# EAGLE design TFG (EAGLE 7.3.0)
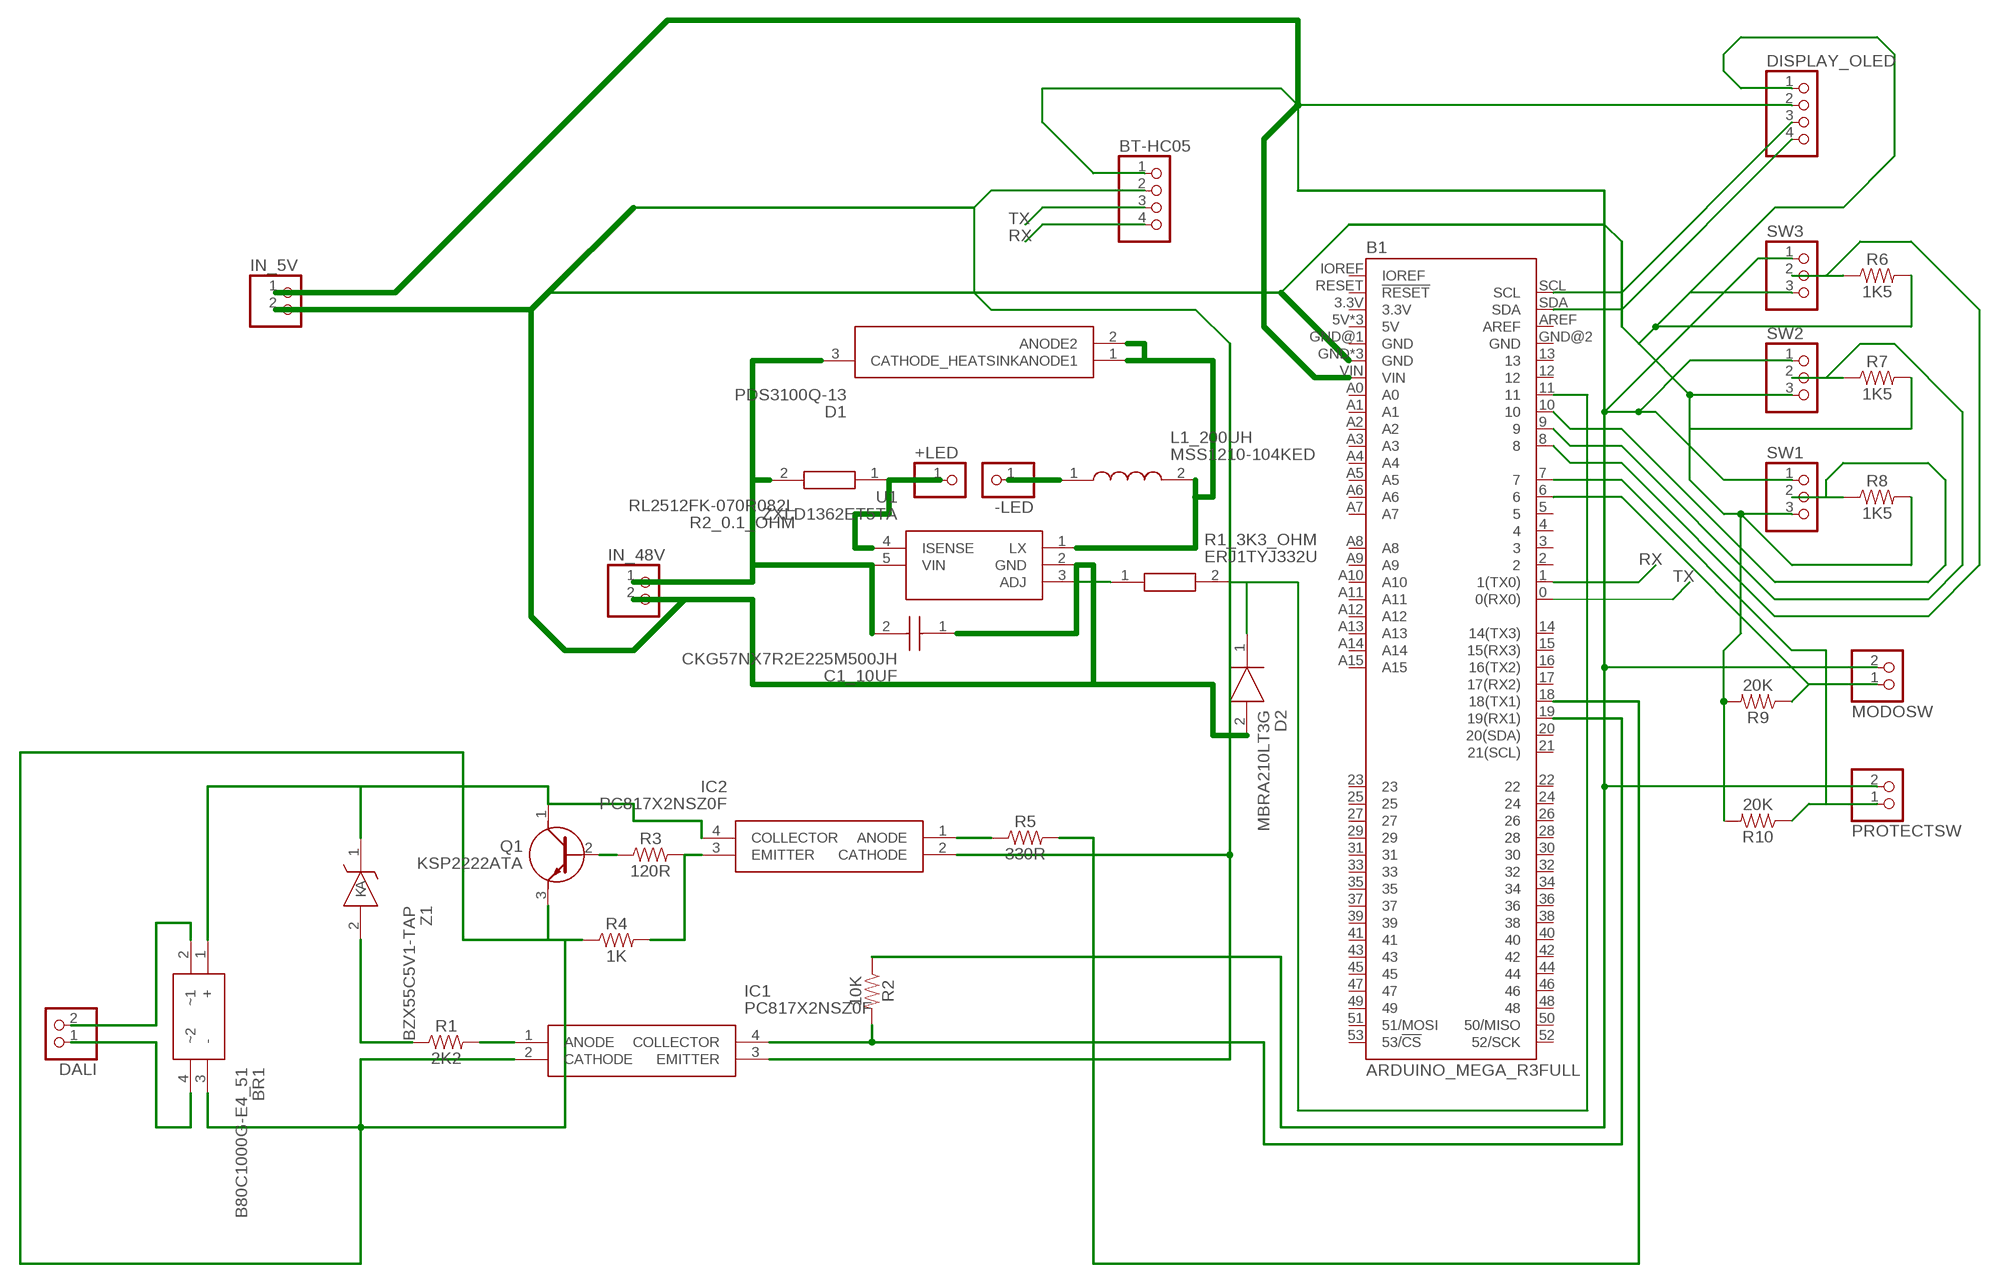
[diagram p0: schematic, sheet 1]

## Parts
+LED  PINHD-1X1  [1X01]
-LED  PINHD-1X1  [1X01]
B1  ARDUINO_MEGA_R3FULL  [ARDUINO_MEGA_NO_SILK]
BR1  B80C1000G-E4_51  [WOG_1]
BT-HC05  PINHD-1X4  [1X04]
C1_10UF  CKG57NX7R2E225M500JH  [CAPC6050X550N]
D1  PDS3100Q-13  [POWERDI5]
D2  MBRA210LT3G  [DIOM5226X220N]
DALI  PINHD-1X2  [1X02]
DISPLAY_OLED  PINHD-1X4  [1X04]
IC1  PC817X2NSZ0F  [DIP762W60P254L458H400Q4N]
IC2  PC817X2NSZ0F  [DIP762W60P254L458H400Q4N]
IN_5V  PINHD-1X2  [1X02]
IN_48V  PINHD-1X2  [1X02]
L1_200UH  MSS1210-104KED  [INDPM120120X1020N]
MODOSW  PINHD-1X2  [1X02]
PROTECTSW  PINHD-1X2  [1X02]
Q1  KSP2222ATA  [TO-92_FAIRCHILD]
R1  2K2  10MOHM-HORIZ-1/4W-5%  [AXIAL-0.3]
R1_3K3_OHM  ERJ1TYJ332U  [RESC6432X70N]
R2  10K  10MOHM-HORIZ-1/4W-5%  [AXIAL-0.3]
R2_0.1_OHM  RL2512FK-070R082L  [RESC6432X65N]
R3  120R  10MOHM-HORIZ-1/4W-5%  [AXIAL-0.3]
R4  1K  10MOHM-HORIZ-1/4W-5%  [AXIAL-0.3]
R5  330R  10MOHM-HORIZ-1/4W-5%  [AXIAL-0.3]
R6  1K5  10MOHM-HORIZ-1/4W-5%  [AXIAL-0.3]
R7  1K5  10MOHM-HORIZ-1/4W-5%  [AXIAL-0.3]
R8  1K5  10MOHM-HORIZ-1/4W-5%  [AXIAL-0.3]
R9  20K  10MOHM-HORIZ-1/4W-5%  [AXIAL-0.3]
R10  20K  10MOHM-HORIZ-1/4W-5%  [AXIAL-0.3]
SW1  PINHD-1X3  [1X03]
SW2  PINHD-1X3  [1X03]
SW3  PINHD-1X3  [1X03]
U1  ZXLD1362ET5TA  [SOT95P270X145-5N]
Z1  BZX55C5V1-TAP  [DIOAD950W60L350D150]

## Nets
2: C1_10UF.2 D1.3(CATHODE_HEATSINK) IN_48V.1 R2_0.1_OHM.2 U1.5(VIN)
N$2: D1.1(ANODE1) D1.2(ANODE2) L1_200UH.2 U1.1(LX)
N$3: B1.GND B1.GND@3(GND) B1.GND@4(GND) BT-HC05.2 C1_10UF.1 D2.2(A) DISPLAY_OLED.1 IC1.3(EMITTER) IC2.2(CATHODE) IN_5V.2 IN_48V.2 R6.P$2 R7.P$2 R8.P$2 R9.P$2 R10.P$2 SW1.3 SW2.3 SW3.3 U1.2(GND)
N$5: -LED.1 L1_200UH.1
N$6: +LED.1 R2_0.1_OHM.1 U1.4(ISENSE)
N$7: B1.9 R7.P$1 SW2.2
N$8: B1.10 R8.P$1 SW1.2
N$9: B1.8 R6.P$1 SW3.2
N$10: R1_3K3_OHM.1 U1.3(ADJ)
N$11: B1.11 D2.1(K) R1_3K3_OHM.2
N$12: BR1.2(~1) DALI.2
N$13: BR1.4(~2) DALI.1
N$14: B1.6 MODOSW.1 R9.P$1
N$15: BR1.1(+) IC2.4(COLLECTOR) Q1.1(C) Z1.1(K)
N$16: R1.P$1 Z1.2(A)
N$17: IC1.1(ANODE) R1.P$2
N$18: B1.19(19(RX1)) IC1.4(COLLECTOR) R2.P$2
N$19: B1.VIN BT-HC05.1 DISPLAY_OLED.2 IN_5V.1 MODOSW.2 PROTECTSW.2 R2.P$1 SW1.1 SW2.1 SW3.1
N$21: IC2.3(EMITTER) R3.P$2 R4.P$2
N$22: Q1.2(B) R3.P$1
N$23: BR1.3(-) IC1.2(CATHODE) Q1.3(E) R4.P$1
N$24: B1.18(18(TX1)) R5.P$2
N$25: IC2.1(ANODE) R5.P$1
N$27: B1.7 PROTECTSW.1 R10.P$1
N$29: B1.SCL DISPLAY_OLED.3
N$30: B1.SDA DISPLAY_OLED.4
RX: B1.1(1(TX0)) BT-HC05.4
TX: B1.0(0(RX0)) BT-HC05.3
Unconnected: B1.2 B1.3 B1.3.3V B1.4 B1.5 B1.5V B1.5V@1(5V) B1.5V@2(5V) B1.12 B1.13 B1.14(14(TX3)) B1.15(15(RX3)) B1.16(16(TX2)) B1.17(17(RX2)) B1.20(20(SDA)) B1.21(21(SCL)) B1.22 B1.23 B1.24 B1.25 B1.26 B1.27 B1.28 B1.29 B1.30 B1.31 B1.32 B1.33 B1.34 B1.35 B1.36 B1.37 B1.38 B1.39 B1.40 B1.41 B1.42 B1.43 B1.44 B1.45 B1.46 B1.47 B1.48 B1.49 B1.50(50/MISO) B1.51(51/MOSI) B1.52(52/SCK) B1.53(53/!CS) B1.A0 B1.A1 B1.A2 B1.A3 B1.A4 B1.A5 B1.A6 B1.A7 B1.A8 B1.A9 B1.A10 B1.A11 B1.A12 B1.A13 B1.A14 B1.A15 B1.AREF B1.GND@1(GND) B1.GND@2(GND) B1.IOREF B1.RESET(!RESET)

## Library data of the parts
+LED -LED = pinhead:PINHD-1X1: PIN HEADER
B1 = SparkFun-Boards:ARDUINO_MEGA_R3: Arduino Mega R3 ATmega2560 R3 compatible footprint. SparkFun Products: Arduino Mega 2560 R3 <https://www.sparkfun.com/products/11061>
BR1 = LibABL:B80C1000G-E4_51: Vishay B80C1000G-E4/51, Bridge Rectifier, 1.2A 125V, 4-Pin WOG Source: Datasheet <http://www.vishay.com/docs/88500/b40c1000g.pdf>; ARROW_PART_NUMBER: B80C1000G-E4/51; ARROW_PRICE/STOCK: http://uk.rs-online.com/web/p/products/1656361; DESCRIPTION: Vishay B80C1000G-E4/51, Bridge Rectifier, 1.2A 125V, 4-Pin WOG; HEIGHT: mm; MANUFACTURER_NAME: Vishay; MANUFACTURER_PART_NUMBER: B80C1000G-E4/51; RS_PART_NUMBER: 1656361; RS_PRICE/STOCK: http://uk.rs-online.com/web/p/products/1656361
BT-HC05 DISPLAY_OLED = pinhead:PINHD-1X4: PIN HEADER
C1_10UF = LibABL:CKG57NX7R2E225M500JH: 2220 X7R Ceramic Capacitor 250V 2.2uF TDK 2.2F Multilayer Ceramic Capacitor (MLCC) 250 V 20% X7R dielectric CKG Surface Mount max op. temp. +125C Source: Datasheet <https://product.tdk.com/info/en/catalog/datasheets/mlcc_commercial_megacap_en.pdf>; ARROW_PART_NUMBER: CKG57NX7R2E225M500JH; ARROW_PRICE/STOCK: https://www.arrow.com/en/products/ckg57nx7r2e225m500jh/tdk; DESCRIPTION: 2220 X7R Ceramic Capacitor 250V 2.2uF TDK 2.2F Multilayer Ceramic Capacitor (MLCC) 250 V 20% X7R dielectric CKG Surface Mount max op. temp. +125C; HEIGHT: 5.5mm; MANUFACTURER_NAME: TDK; MANUFACTURER_PART_NUMBER: CKG57NX7R2E225M500JH; RS_PART_NUMBER: 9214328; RS_PRICE/STOCK: http://uk.rs-online.com/web/p/products/9214328
D1 = LibABL:PDS3100Q-13: Schottky Diodes & Rectifiers Source: Datasheet <https://www.diodes.com/assets/Datasheets/PDS3100Q.pdf>; ARROW_PART_NUMBER: PDS3100Q-13; ARROW_PRICE/STOCK: https://www.arrow.com/en/products/pds3100q-13/diodes-incorporated; DESCRIPTION: Schottky Diodes & Rectifiers; HEIGHT: mm; MANUFACTURER_NAME: Diodes Inc.; MANUFACTURER_PART_NUMBER: PDS3100Q-13
D2 = LibABL:MBRA210LT3G: Source: Datasheet <http://www.onsemi.com/pub/Collateral/MBRA210LT3-D.PDF>; ALLIED_NUMBER: 70339903; ALLIED_PRICE/STOCK: http://www.alliedelec.com/on-semiconductor-mbra210lt3g/70339903/; ARROW_PART_NUMBER: MBRA210LT3G; ARROW_PRICE/STOCK: https://www.arrow.com/en/products/mbra210lt3g/on-semiconductor; HEIGHT: 2.2mm; MANUFACTURER_NAME: ON Semiconductor; MANUFACTURER_PART_NUMBER: MBRA210LT3G; RS_PART_NUMBER: 7925612P; RS_PRICE/STOCK: http://uk.rs-online.com/web/p/products/7925612P
DALI IN_5V IN_48V MODOSW PROTECTSW = pinhead:PINHD-1X2: PIN HEADER
IC1 IC2 = LibABL:PC817X2NSZ0F: Photocoupler 1-CH Transistor 4-Pin PDIP Sharp PC817X2NSZ0F DC Input Transistor Output Optocoupler, Through Hole, 4-Pin PDIP Source: Datasheet <http://www.sharp-world.com/products/device/lineup/data/pdf/datasheet/pc817xnnsz_e.pdf>; ARROW_PART_NUMBER: PC817X2NSZ0F; ARROW_PRICE/STOCK: http://uk.rs-online.com/web/p/products/8264687P; DESCRIPTION: Photocoupler 1-CH Transistor 4-Pin PDIP Sharp PC817X2NSZ0F DC Input Transistor Output Optocoupler, Through Hole, 4-Pin PDIP; HEIGHT: 4mm; MANUFACTURER_NAME: Sharp Microelectronics; MANUFACTURER_PART_NUMBER: PC817X2NSZ0F; RS_PART_NUMBER: 8264687P; RS_PRICE/STOCK: http://uk.rs-online.com/web/p/products/8264687P
L1_200UH = LibABL:MSS1210-104KED: COILCRAFT - MSS1210-104KED - INDUCTOR, PWR, 100UH,3.4A,10%,3.6MHZ Source: Datasheet <http://www.coilcraft.com/pdfs/MSS1210.pdf>; ARROW_PART_NUMBER: MSS1210-104KED; DESCRIPTION: COILCRAFT - MSS1210-104KED - INDUCTOR, PWR, 100UH,3.4A,10%,3.6MHZ; HEIGHT: 10.2mm; MANUFACTURER_NAME: COILCRAFT; MANUFACTURER_PART_NUMBER: MSS1210-104KED
Q1 = LibABL:KSP2222ATA: Transistor GP BJT NPN 40V 0.6A TO92-3 Source: Datasheet <http://docs-europe.electrocomponents.com/webdocs/0f9b/0900766b80f9b313.pdf>; ARROW_PART_NUMBER: KSP2222ATA; ARROW_PRICE/STOCK: http://uk.rs-online.com/web/p/bipolar-transistors/7390417/?source=DS; DESCRIPTION: Transistor GP BJT NPN 40V 0.6A TO92-3; HEIGHT: mm; MANUFACTURER_NAME: Fairchild Semiconductor; MANUFACTURER_PART_NUMBER: KSP2222ATA; RS_PART_NUMBER: 7390417; RS_PRICE/STOCK: http://uk.rs-online.com/web/p/bipolar-transistors/7390417/?source=DS
R1-R10 = SparkFun-Resistors:10MOHM: RES-09327; PROD_ID: RES-09327; VALUE: 10M
R1_3K3_OHM = LibABL:ERJ1TYJ332U: PANASONIC ELECTRONIC COMPONENTS - ERJ1TYJ332U - RES, THICK FILM, 3K3, 5%, 1W, 2512 Source: Datasheet <https://industrial.panasonic.com/cdbs/www-data/pdf/RDA0000/AOA0000C84.pdf>; ARROW_PART_NUMBER: ERJ1TYJ332U; DESCRIPTION: PANASONIC ELECTRONIC COMPONENTS - ERJ1TYJ332U - RES, THICK FILM, 3K3, 5%, 1W, 2512; HEIGHT: 0.7mm; MANUFACTURER_NAME: Panasonic; MANUFACTURER_PART_NUMBER: ERJ1TYJ332U
R2_0.1_OHM = LibABL:RL2512FK-070R082L: Current Sense Resistors - SMD 0.082 Ohm 1% 1W Source: Datasheet <https://www.mouser.com/ds/2/447/PYu-RL_521_RoHS_L_5-2927.pdf>; ARROW_PART_NUMBER: RL2512FK-070R082L; DESCRIPTION: Current Sense Resistors - SMD 0.082 Ohm 1% 1W; HEIGHT: 0.65mm; MANUFACTURER_NAME: YAGEO (PHYCOMP); MANUFACTURER_PART_NUMBER: RL2512FK-070R082L
SW1-SW3 = pinhead:PINHD-1X3: PIN HEADER
U1 = LibABL:ZXLD1362ET5TA: 60V 1A LED DRIVER WITH AEC-Q100 Source: Datasheet <http://componentsearchengine.com/Datasheets/1/ZXLD1362ET5TA.pdf>; ARROW_PART_NUMBER: ZXLD1362ET5TA; ARROW_PRICE/STOCK: https://www.arrow.com/en/products/zxld1362et5ta/diodes-incorporated; DESCRIPTION: 60V 1A LED DRIVER WITH AEC-Q100; HEIGHT: mm; MANUFACTURER_NAME: Diodes Inc.; MANUFACTURER_PART_NUMBER: ZXLD1362ET5TA; RS_PART_NUMBER: 1219947; RS_PRICE/STOCK: http://uk.rs-online.com/web/p/products/1219947
Z1 = LibABL:BZX55C5V1-TAP: Vishay Zener Diode, 5.1V 6% 500 mW Through Hole 2-Pin DO-35 Source: Datasheet <http://www.farnell.com/datasheets/2046255.pdf>; ARROW_PART_NUMBER: BZX55C5V1-TAP; ARROW_PRICE/STOCK: https://www.arrow.com/en/products/bzx55c5v1-tap/vishay; DESCRIPTION: Vishay Zener Diode, 5.1V 6% 500 mW Through Hole 2-Pin DO-35; HEIGHT: mm; MANUFACTURER_NAME: Vishay; MANUFACTURER_PART_NUMBER: BZX55C5V1-TAP; RS_PART_NUMBER: 6997809P; RS_PRICE/STOCK: http://uk.rs-online.com/web/p/products/6997809P

## Board
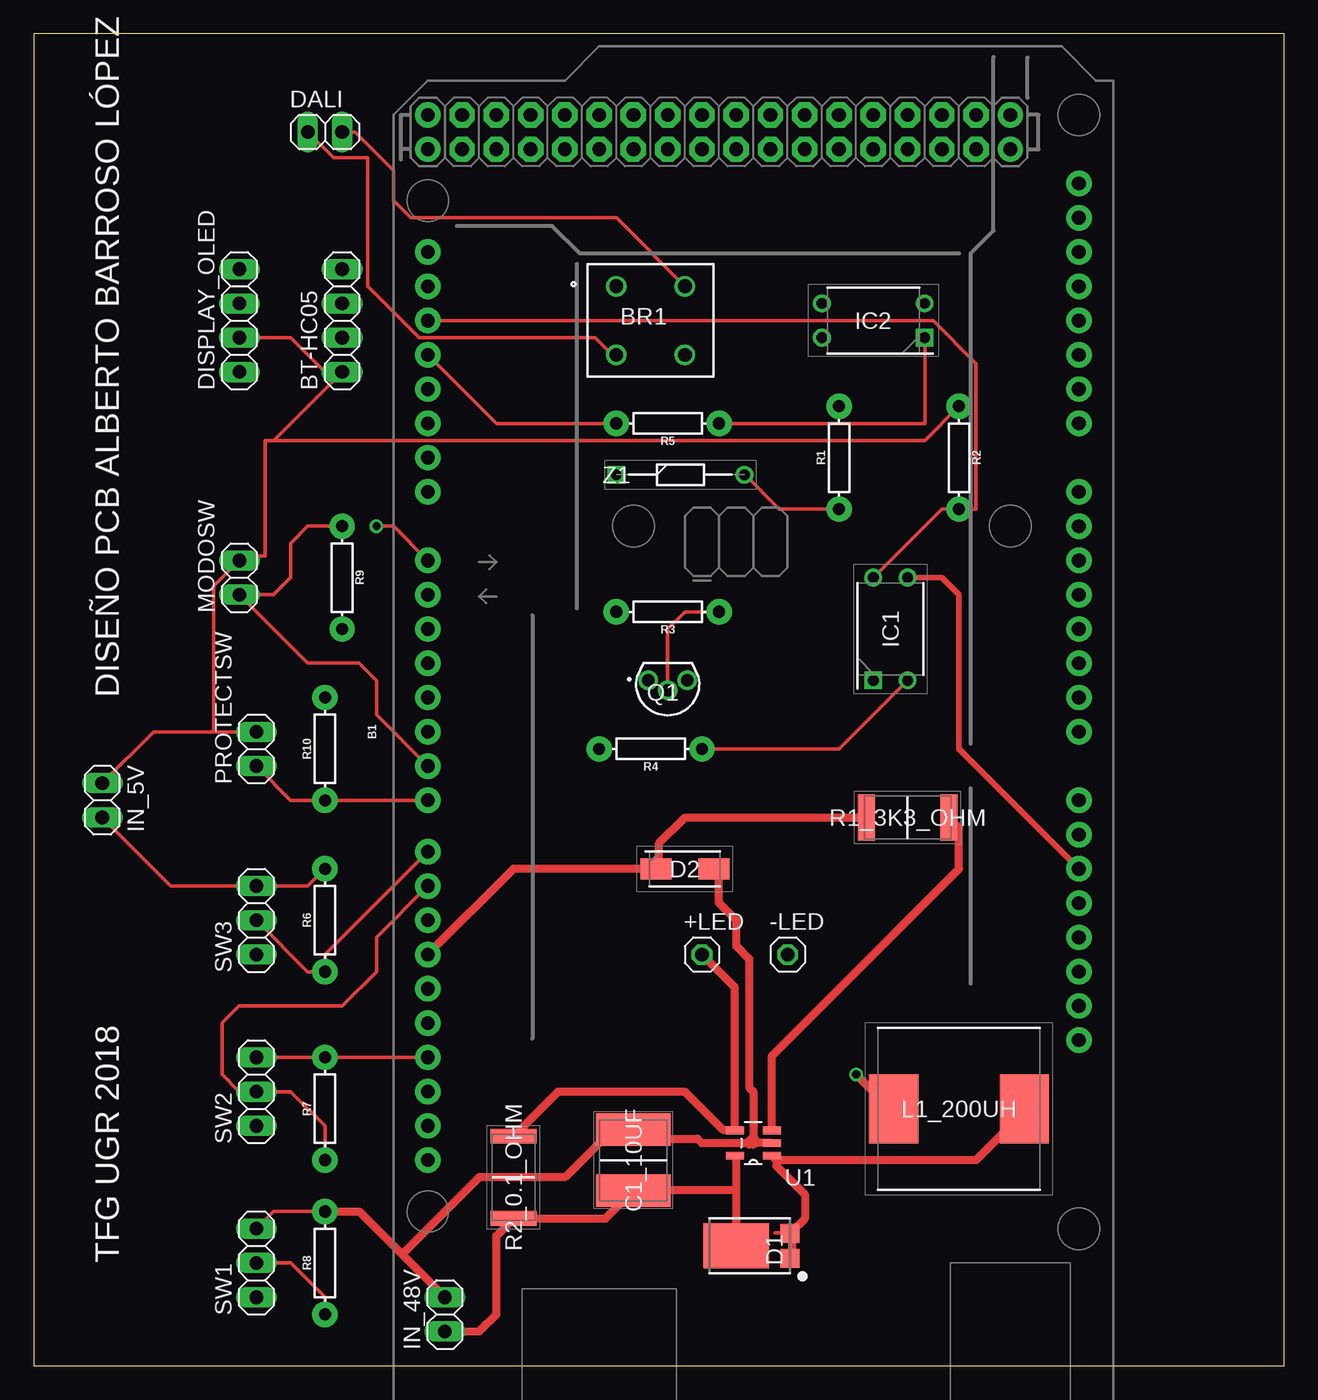
[diagram p1: board, top side]
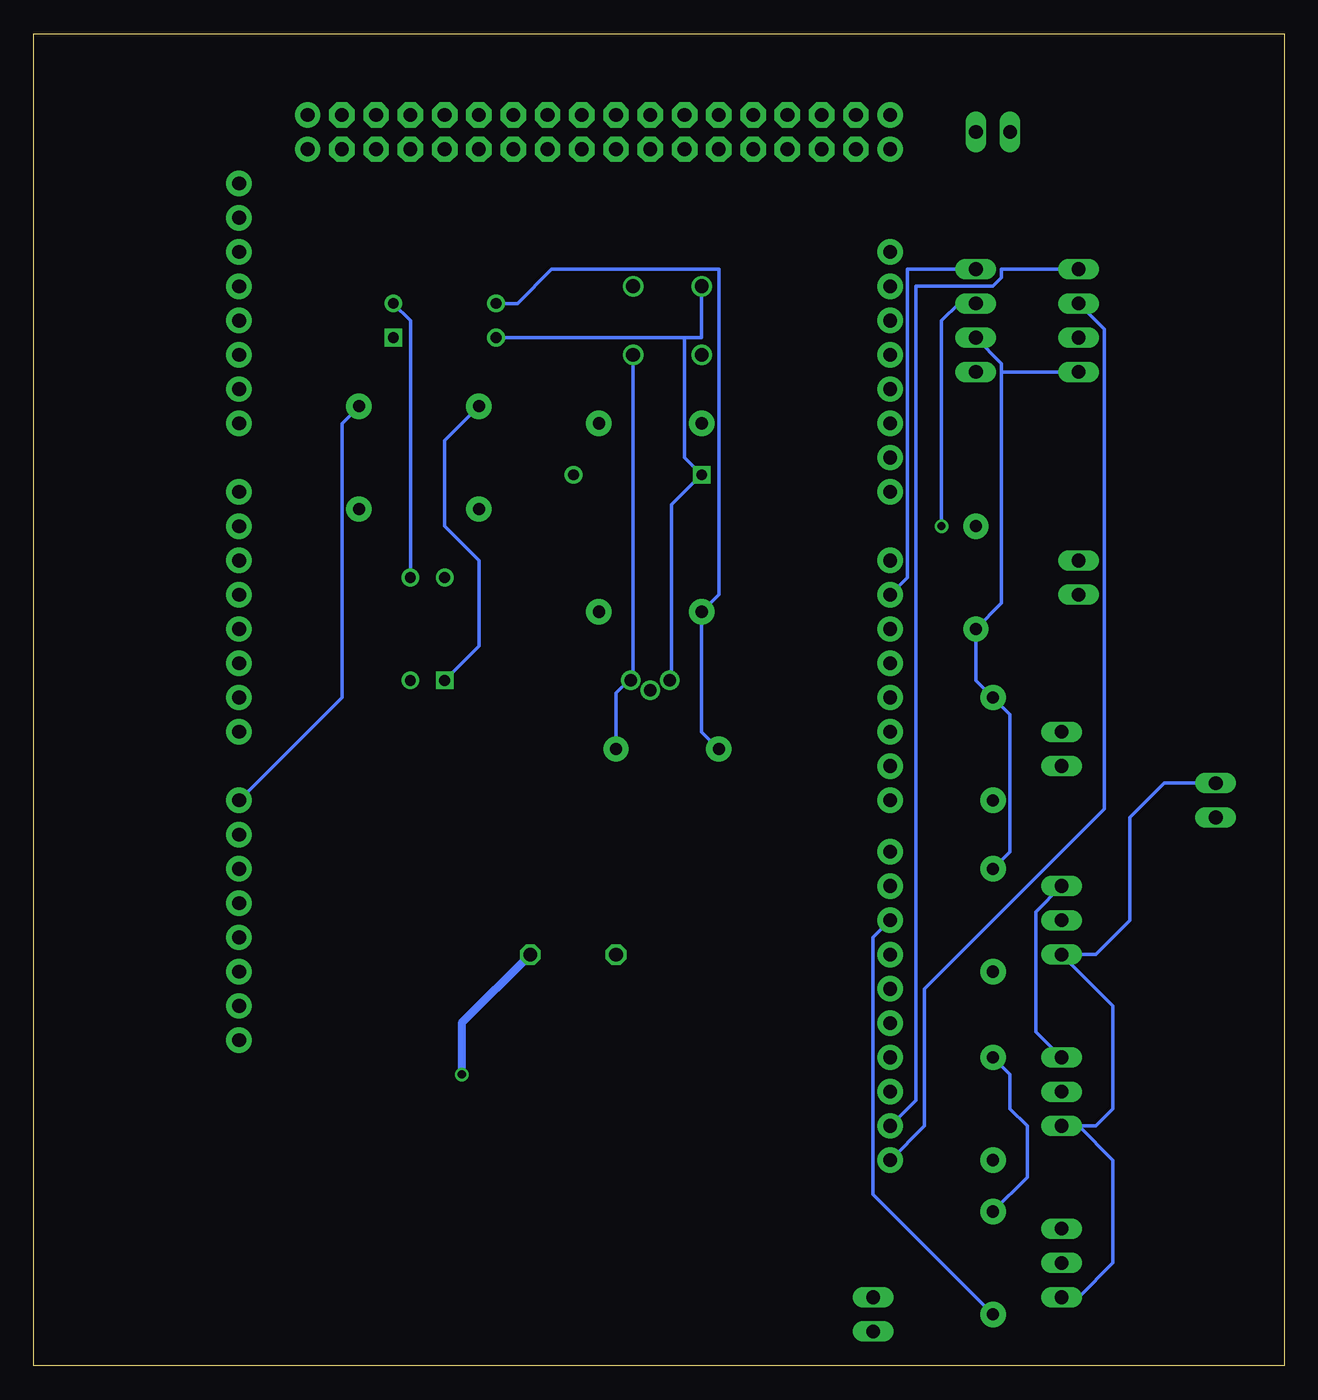
[diagram p2: board, bottom side, seen from below]

Size 92.69 x 98.73 mm. Coordinates in mm from the lower left corner, seen from the top.
Outline: 0,0 92.69,0 92.69,98.73 0,98.73 0,0
Copper layers (1*16): Top 0.035mm / dielectric 1.5mm / Bottom 0.035mm
Design rules "default *": minimum track width 10mil, minimum drill 24mil, track to track 8mil, track to pad 8mil, pad to pad 8mil, via to via 8mil, smd to smd 8mil, copper to edge 40mil, drill to drill 8mil, minimum pad ring 10mil, minimum via ring 8mil, stop-mask expansion 2mil, vias tented up to drill 0mil, thermal gap 10mil

### Footprints (pad centres in the part's own frame; a part is rotated, then mirrored left to right if it is on the bottom)
1X01 = drill 1.016 octagon: 1 0,0
ARDUINO_MEGA_NO_SILK = drill 1.016 pad 1.88: 0 13.97,24.13; 1 11.43,24.13; 2 8.89,24.13; 3 6.35,24.13; 3.3V -13.97,-24.13; 4 3.81,24.13; 5 1.27,24.13; 5V -11.43,-24.13; 5V@1 44.45,24.13; 5V@2 46.99,24.13; 6 -1.27,24.13; 7 -3.81,24.13; 8 -7.62,24.13; 9 -10.16,24.13; 10 -12.7,24.13; 11 -15.24,24.13; 12 -17.78,24.13; 13 -20.32,24.13; 14 19.05,24.13; 15 21.59,24.13; 16 24.13,24.13; 17 26.67,24.13; 18 29.21,24.13; 19 31.75,24.13; 20 34.29,24.13; 21 36.83,24.13; A0 1.27,-24.13; A1 3.81,-24.13; A2 6.35,-24.13; A3 8.89,-24.13; A4 11.43,-24.13; A5 13.97,-24.13; A6 16.51,-24.13; A7 19.05,-24.13; A8 24.13,-24.13; A9 26.67,-24.13; A10 29.21,-24.13; A11 31.75,-24.13; A12 34.29,-24.13; A13 36.83,-24.13; A14 39.37,-24.13; A15 41.91,-24.13; AREF -25.4,24.13; GND -8.89,-24.13; GND@1 -6.35,-24.13; GND@2 44.45,-19.05; GND@3 46.99,-19.05; GND@4 -22.86,24.13; IOREF -19.05,-24.13; NC -21.59,-24.13; RESET -16.51,-24.13; SCL -30.48,24.13; SDA -27.94,24.13; VIN -3.81,-24.13 | drill 1.016 pad 1.88 octagon: 22 44.45,21.59; 23 46.99,21.59; 24 44.45,19.05; 25 46.99,19.05; 26 44.45,16.51; 27 46.99,16.51; 28 44.45,13.97; 29 46.99,13.97; 30 44.45,11.43; 31 46.99,11.43; 32 44.45,8.89; 33 46.99,8.89; 34 44.45,6.35; 35 46.99,6.35; 36 44.45,3.81; 37 46.99,3.81; 38 44.45,1.27; 39 46.99,1.27; 40 44.45,-1.27; 41 46.99,-1.27; 42 44.45,-3.81; 43 46.99,-3.81; 44 44.45,-6.35; 45 46.99,-6.35; 46 44.45,-8.89; 47 46.99,-8.89; 48 44.45,-11.43; 49 46.99,-11.43; 50 44.45,-13.97; 51 46.99,-13.97; 52 44.45,-16.51; 53 46.99,-16.51
WOG_1 = drill 1.01 pad 1.51: 1 -2.55,2.55; 2 2.55,2.55; 3 2.55,-2.55; 4 -2.55,-2.55
1X04 = drill 1.016 long: 1 -3.81,0; 2 -1.27,0; 3 1.27,0; 4 3.81,0
CAPC6050X550N = smd 2.39 x 5.51: 1 -2.26,0; 2 2.26,0
POWERDI5 = smd 1.39 x 1.4: 1 -0.92,-3.982; 2 0.92,-3.982 | smd 3.36 x 4.86: 3 0,0
DIOM5226X220N = smd 2.3 x 1.55: 1 -2.15,0; 2 2.15,0
1X02 = drill 1.016 long: 1 -1.27,0; 2 1.27,0
DIP762W60P254L458H400Q4N = drill 0.8 pad 1.2 square: 1 -3.81,1.27 | drill 0.8 pad 1.2: 2 -3.81,-1.27; 3 3.81,-1.27; 4 3.81,1.27
INDPM120120X1020N = smd 3.65 x 5.1: 1 -4.85,0; 2 4.85,0
TO-92_FAIRCHILD = drill 0.94 pad 1.44: 1 -1.45,-1.26; 2 0,-2.01; 3 1.45,-1.26
AXIAL-0.3 = drill 0.9 pad 1.88: P$1 -3.81,0; P$2 3.81,0
RESC6432X70N = smd 1.25 x 3.4: 1 -3.05,0; 2 3.05,0
RESC6432X65N = smd 1.1 x 3.4: 1 -3.05,0; 2 3.05,0
1X03 = drill 1.016 long: 1 -2.54,0; 2 0,0; 3 2.54,0
SOT95P270X145-5N = smd 1.321 x 0.559: 1 -1.372,0.94; 2 -1.372,0; 3 -1.372,-0.94; 4 1.372,-0.94; 5 1.372,0.94
DIOAD950W60L350D150 = drill 0.8 pad 1.2 square: 1 0,0 | drill 0.8 pad 1.2: 2 9.5,0

### Placement (x,y rotation side)
+LED  49.53,30.48 0 top
-LED  55.88,30.48 0 top
B1  53.34,45.72 90 top
BR1  45.72,77.47 0 top
BT-HC05  22.86,77.47 90 top
C1_10UF  44.45,15.24 270 top
D1  52.07,8.89 90 top
D2  48.26,36.83 0 top
DALI  21.59,91.44 0 top
DISPLAY_OLED  15.24,77.47 90 top
IC1  63.5,54.61 90 top
IC2  62.23,77.47 180 top
IN_5V  5.08,41.91 270 top
IN_48V  30.48,3.81 90 top
L1_200UH  68.58,19.05 0 top
MODOSW  15.24,58.42 90 top
PROTECTSW  16.51,45.72 90 top
Q1  46.99,52.07 0 top
R1  59.69,67.31 90 top
R1_3K3_OHM  64.77,40.64 180 top
R2  68.58,67.31 270 top
R2_0.1_OHM  35.56,13.97 270 top
R3  46.99,55.88 180 top
R4  45.72,45.72 180 top
R5  46.99,69.85 180 top
R6  21.59,33.02 90 top
R7  21.59,19.05 90 top
R8  21.59,7.62 90 top
R9  22.86,58.42 270 top
R10  21.59,45.72 90 top
SW1  16.51,7.62 90 top
SW2  16.51,20.32 90 top
SW3  16.51,33.02 90 top
U1  53.34,16.51 180 top
Z1  43.18,66.04 0 top

### Tracks (layer width: path | path; a pad name or v marks a point on that pad's centre or on a via)
2
  Top 0.254: 44.45,13.02 C1_10UF.2
  Top 0.61: D1.3 52.07,13.02 | 52.07,13.02 52.07,15.56 51.98,15.56 U1.5 | 52.07,13.02 44.45,13.02 | IN_48V.1 33.02,2.54 34.29,3.81 34.29,9.65 R2_0.1_OHM.2 42.39,10.92 C1_10UF.2
N$2
  Top 0.254: 54.93,9.84 55.88,9.84 D1.2 56.2,9.53 | 56.2,8.25 D1.1 | 73.34,19.05 L1_200UH.2
  Top 0.61: 56.2,9.53 56.2,8.25 | 73.34,18.73 69.85,15.24 55.04,15.24 | 55.04,15.24 55.04,14.81 57.15,12.7 57.15,10.91 D1.2 | U1.1 55.04,15.24
  Top 0.813: 73.34,19.05 73.34,18.73
N$3
  Top 0.254: 45.09,16.83 44.45,17.46 C1_10UF.1 | 50.48,36.83 D2.2 | SW2.3 R7.P$2 B1.GND@4 | SW1.3 17.78,11.43 R8.P$2 | IN_5V.2 10.16,35.56 SW3.3 20.32,35.56 R6.P$2
  Top 0.305: 53.02,16.83 53.34,16.83
  Top 0.406: IC1.3 67.31,58.42 68.58,57.15 68.58,45.72 B1.GND
  Top 0.61: 27.3,8.25 24.13,11.43 R8.P$2 | 27.3,8.25 28.57,6.98 IN_48V.2 | 45.09,16.83 49.21,16.83 49.53,16.51 53.02,16.51 | U1.2 53.34,16.51 53.34,20.32 53.02,20.64 53.02,30.16 52.07,31.11 52.07,33.02 50.8,34.29 50.8,36.44 D2.2 | 42.86,17.46 39.37,13.97 33.02,13.97 27.3,8.25
  Top 0.813: 53.02,16.51 53.18,16.67 | 53.18,16.67 53.34,16.83 | 53.34,16.51 53.18,16.67 | 44.45,17.46 42.86,17.46
  Bottom 0.254: IC1.3 64.77,77.47 IC2.2 | R7.P$2 20.32,21.59 20.32,19.05 19.05,17.78 19.05,13.97 R8.P$2 | 20.96,73.66 DISPLAY_OLED.1 | 20.96,73.66 20.96,74.3 BT-HC05.2 | R6.P$2 20.32,38.1 20.32,48.26 R10.P$2 22.86,50.8 R9.P$2 20.96,56.52 20.96,73.66 | SW2.3 18.41,24.77 18.41,33.66 SW3.3
N$5  (via drill 0.61)
  Top 0.254: 63.5,19.05 L1_200UH.1
  Top 0.61: 63.5,19.05 v60.96,21.59
  Bottom 0.61: -LED.1 60.96,25.4 v60.96,21.59
N$6
  Top 0.61: +LED.1 51.97,28.04 U1.4 51.13,17.45 48.26,20.32 38.86,20.32 R2_0.1_OHM.1
N$7
  Top 0.254: R7.P$1 21.59,17.78 19.05,20.32 SW2.2 15.24,20.32 13.97,21.59 13.97,25.4 15.24,26.67 22.86,26.67 25.4,29.21 25.4,31.75 B1.9
N$8
  Top 0.254: R8.P$1 21.59,5.08 19.05,7.62 SW1.2
  Bottom 0.254: B1.10 30.48,31.75 30.48,12.7 R8.P$1
N$9
  Top 0.254: SW3.2 20.32,29.21 R6.P$1 21.59,30.48 B1.8
N$10
  Top 0.61: U1.3 54.71,22.96 68.58,36.83 68.58,39.88 R1_3K3_OHM.1
N$11
  Top 0.254: 46.36,36.83 D2.1
  Top 0.61: B1.11 35.56,36.83 D2.1 | 46.36,36.83 46.36,38.73 48.26,40.64 R1_3K3_OHM.2
N$12
  Top 0.254: DALI.2 23.81,91.44 26.67,88.58 26.67,86.36 27.94,85.09 43.18,85.09 48.25,80.02 BR1.2
N$13
  Top 0.254: DALI.1 22.22,89.53 24.76,89.53 24.76,80.01 28.57,76.2 41.59,76.2 42.86,74.93 BR1.4
N$14
  Top 0.254: B1.6 25.4,48.26 25.4,50.8 24.13,52.07 20.32,52.07 MODOSW.1 17.78,57.15 19.05,58.42 19.05,60.96 20.32,62.23 R9.P$1
N$15
  Bottom 0.254: Q1.1 45.4,51.12 45.4,63.82 Z1.1 44.45,67.31 44.45,76.2 | 44.45,76.2 43.18,76.2 BR1.1 | 44.45,76.2 IC2.4
N$16
  Top 0.254: R1.P$1 55.25,63.5 52.7,66.04 Z1.2
N$17
  Bottom 0.254: IC1.1 59.69,53.34 59.69,59.69 62.23,62.23 62.23,68.58 R1.P$2
N$18
  Top 0.254: IC1.4 67.31,63.5 R2.P$2 69.85,63.5 69.85,74.3 66.67,77.47 B1.19
N$19
  Top 0.254: IN_5V.1 8.89,46.99 13.33,46.99 | PROTECTSW.2 13.33,46.99 | 13.33,46.99 13.33,57.78 MODOSW.2 15.56,60.01 17.14,60.01 17.14,68.58 17.78,68.58 | R2.P$1 66.04,68.58 17.78,68.58 | 17.78,68.58 BT-HC05.1 21.59,73.66 19.05,76.2 DISPLAY_OLED.2
  Bottom 0.254: B1.VIN 69.85,49.53 69.85,69.85 R2.P$1 | SW1.1 15.24,5.08 12.7,7.62 12.7,15.24 15.24,17.78 | 15.24,17.78 SW2.1 | 15.24,17.78 13.97,17.78 12.7,19.05 12.7,26.67 SW3.1 13.97,30.48 11.43,33.02 11.43,40.64 8.89,43.18 IN_5V.1
N$21
  Bottom 0.254: IC2.3 56.83,78.74 54.29,81.28 41.91,81.28 41.91,57.15 R3.P$2 43.18,46.99 R4.P$2
N$22
  Top 0.254: Q1.2 46.99,54.61 48.26,55.88 R3.P$1
N$23
  Top 0.254: IC1.2 59.69,45.72 R4.P$1
  Bottom 0.254: R4.P$1 49.53,49.85 48.58,50.8 Q1.3 48.26,51.12 48.26,74.61 BR1.3
N$24
  Top 0.254: B1.18 34.29,69.85 R5.P$2
N$25
  Top 0.254: IC2.1 66.04,69.85 R5.P$1
N$27
  Top 0.254: PROTECTSW.1 19.05,41.91 R10.P$1 B1.7
N$29
  Bottom 0.254: DISPLAY_OLED.3 13.33,76.83 13.33,41.27 26.67,27.94 26.67,17.78 B1.SCL
N$30
  Bottom 0.254: DISPLAY_OLED.4 20.96,81.28 20.96,80.64 21.59,80.01 27.3,80.01 27.3,19.69 B1.SDA
RX
  Bottom 0.254: B1.1 27.94,58.42 27.94,81.28 BT-HC05.4
TX  (via drill 0.6)
  Top 0.254: v25.4,62.23 26.67,62.23 B1.0
  Bottom 0.254: BT-HC05.3 24.13,78.74 25.4,77.47 v25.4,62.23

### Text on the board
tNames: DISEÑO PCB ALBERTO BARROSO LÓPEZ | TFG UGR 2018